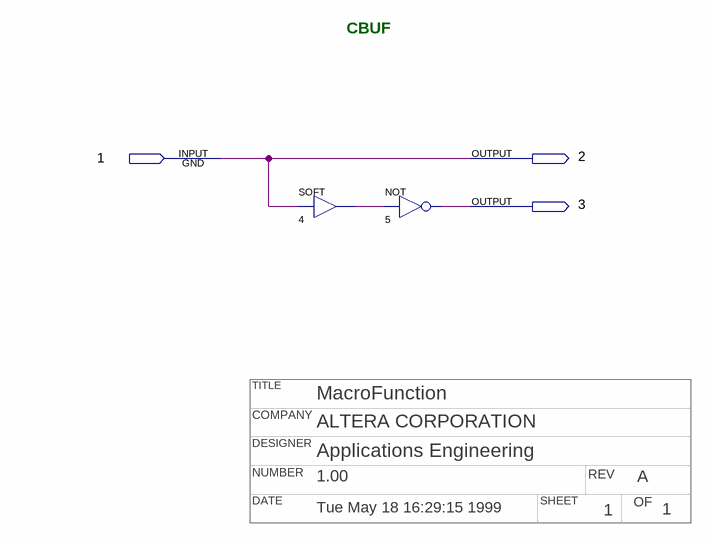
[diagram p0: schematic sheet]
// Quartus schematic cbuf.bdf as structural Verilog: 2 symbols, 3 pins
// Title block: TITLE: MacroFunction; COMPANY: ALTERA CORPORATION; DESIGNER: Applications Engineering; NUMBER: 1.00; REV: A; DATE: Tue May 18 16:29:15 1999; SHEET: 1; OF: 1
module cbuf (
  input  \1 ,
  output \2 ,
  output \3 
);

  wire n4_out;

  SOFT u_4 (.IN(\1 ), .OUT(n4_out));
  not u_5 (\3 , n4_out);

  assign \2  = \1 ;

  // Notes on the sheet:
  //   CBUF
endmodule
